# EAGLE design board 2 (EAGLE 8.4.1)
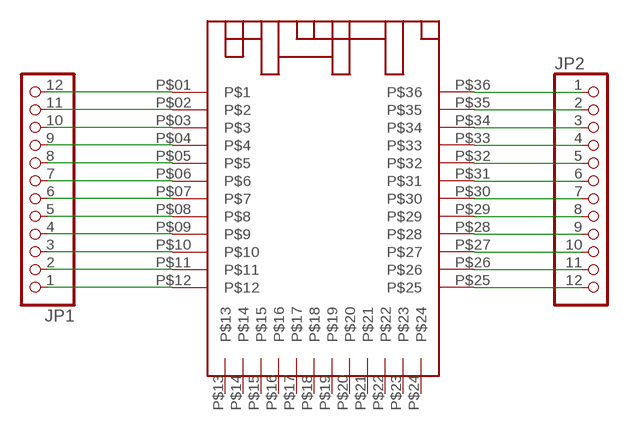
[diagram p0: schematic, sheet 1]

## Parts
JP1  PINHD-1X12  [1X12]
JP2  PINHD-1X12  [1X12]
U$1  HZX_MODULE  [SMD_PAD_VERSION]

## Nets
N$1: JP1.1 U$1.P$12
N$2: JP1.2 U$1.P$11
N$3: JP1.3 U$1.P$10
N$4: JP1.4 U$1.P$09
N$5: JP1.5 U$1.P$08
N$6: JP1.6 U$1.P$07
N$7: JP1.7 U$1.P$06
N$8: JP1.8 U$1.P$05
N$9: JP1.9 U$1.P$04
N$10: JP1.10 U$1.P$03
N$11: JP1.11 U$1.P$02
N$12: JP1.12 U$1.P$01
N$13: JP2.1 U$1.P$36
N$14: JP2.2 U$1.P$35
N$15: JP2.3 U$1.P$34
N$16: JP2.4 U$1.P$33
N$17: JP2.5 U$1.P$32
N$18: JP2.6 U$1.P$31
N$19: JP2.7 U$1.P$30
N$20: JP2.8 U$1.P$29
N$21: JP2.9 U$1.P$28
N$22: JP2.10 U$1.P$27
N$23: JP2.11 U$1.P$26
N$24: JP2.12 U$1.P$25
Unconnected: U$1.P$13 U$1.P$14 U$1.P$15 U$1.P$16 U$1.P$17 U$1.P$18 U$1.P$19 U$1.P$20 U$1.P$21 U$1.P$22 U$1.P$23 U$1.P$24

## Library data of the parts
JP1 JP2 = pinhead:PINHD-1X12: PIN HEADER
U$1 = HZX_MODULE:HZX_MODULE; AUTHOR: Agam

## Board
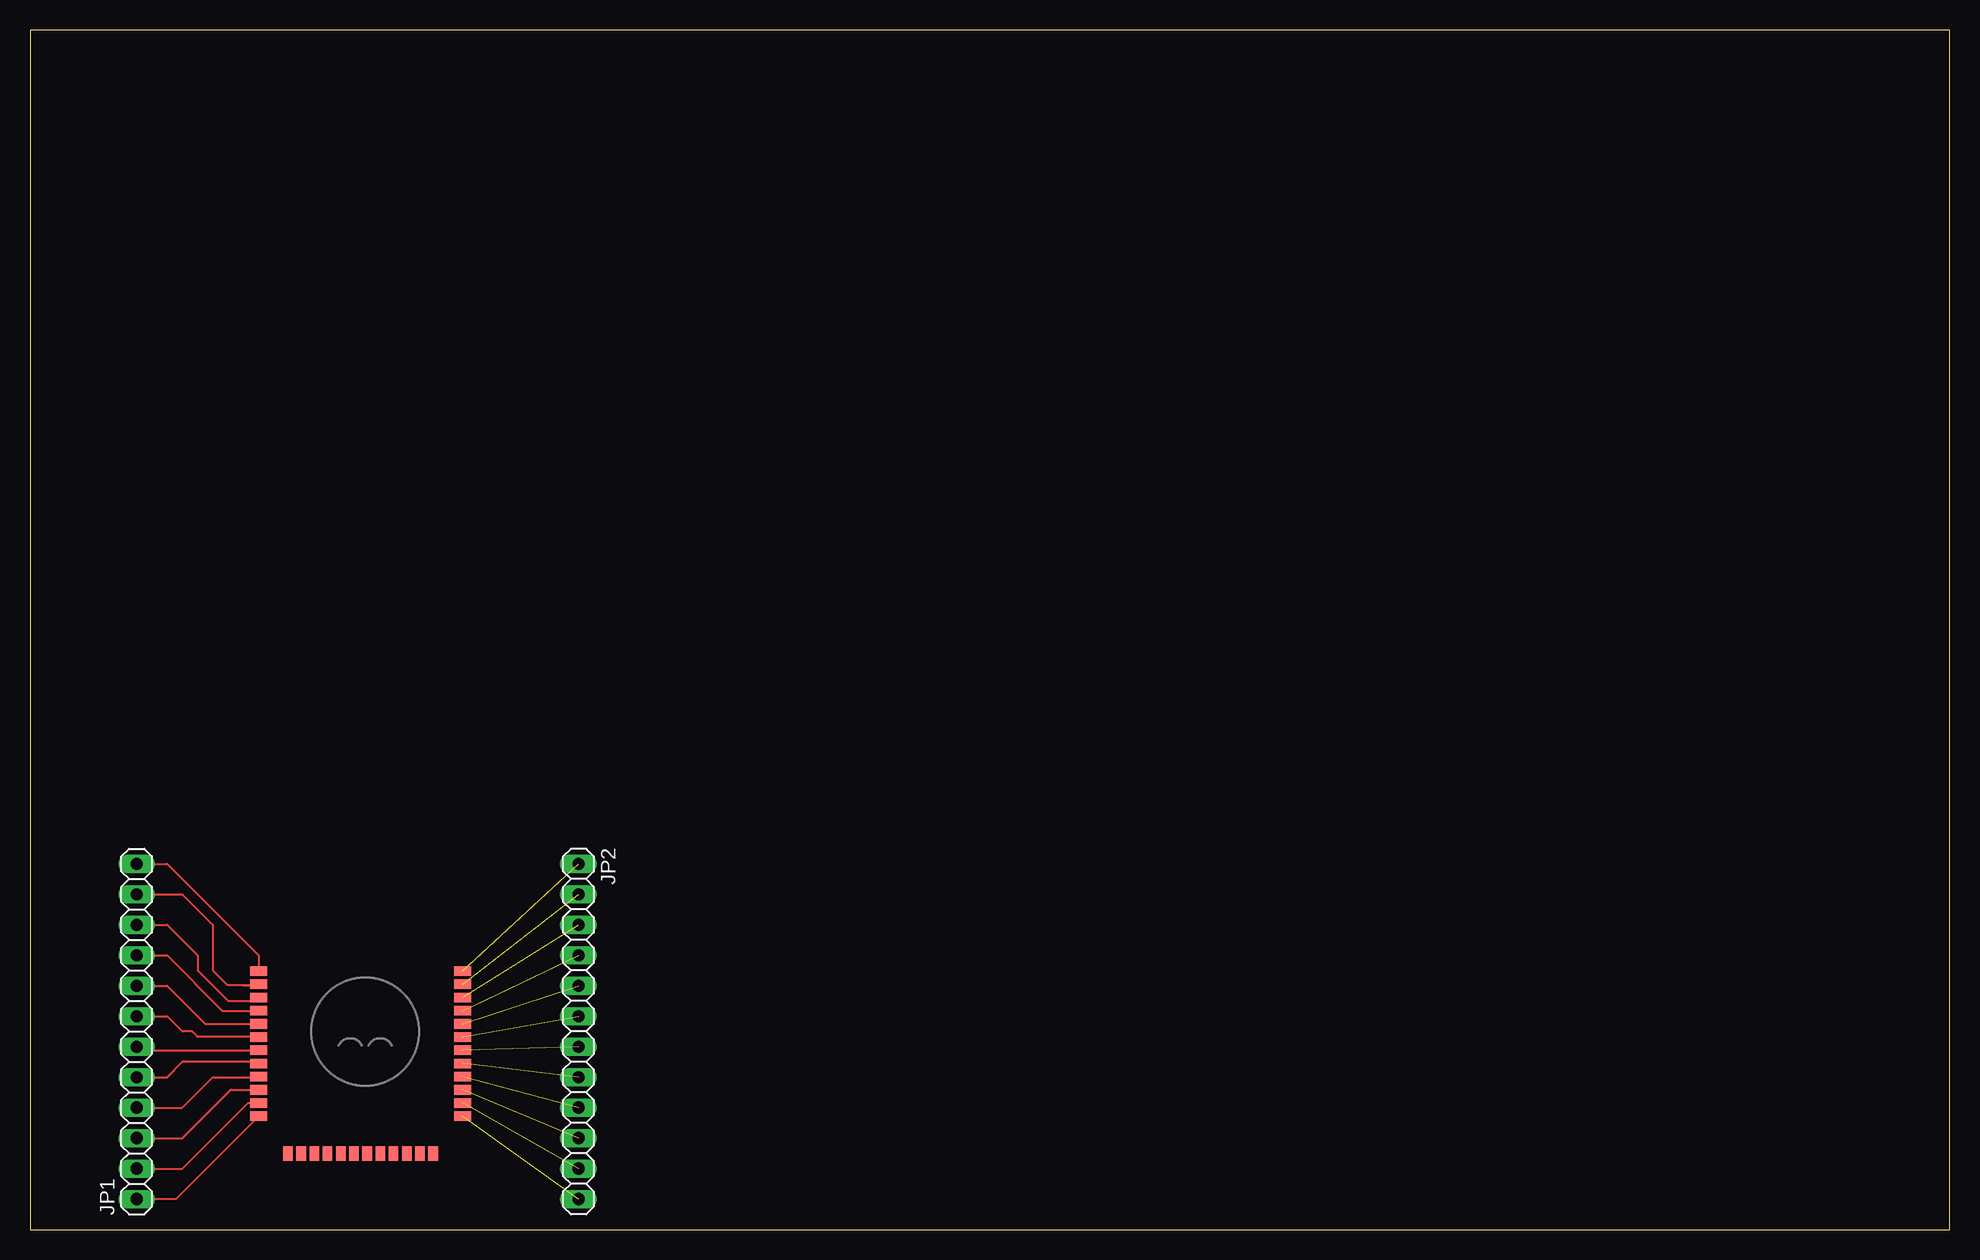
[diagram p1: board, top side]

Size 160 x 100 mm. Coordinates in mm from the lower left corner, seen from the top.
Outline: 0,0 160,0 160,100 0,100 0,0
Copper layers (1*16): Top 0.035mm / dielectric 1.5mm / Bottom 0.035mm
Design rules "default": minimum track width 6mil, minimum drill 0.35mm, track to track 6mil, track to pad 6mil, pad to pad 6mil, via to via 6mil, smd to smd 6mil, copper to edge 40mil, drill to drill 6mil, minimum pad ring 10mil, minimum via ring 8mil, stop-mask expansion 4mil, vias tented up to drill 0mil, thermal gap 10mil

### Footprints (pad centres in the part's own frame; a part is rotated, then mirrored left to right if it is on the bottom)
1X12 = drill 1.016 long: 1 -13.97,0; 2 -11.43,0; 3 -8.89,0; 4 -6.35,0; 5 -3.81,0; 6 -1.27,0; 7 1.27,0; 8 3.81,0; 9 6.35,0; 10 8.89,0; 11 11.43,0; 12 13.97,0
SMD_PAD_VERSION = smd 1.4 x 0.8: P$01 0,15.2; P$02 0,14.1; P$03 0,13; P$04 0,11.9; P$05 0,10.8; P$06 0,9.7; P$07 0,8.6; P$08 0,7.5; P$09 0,6.4; P$10 0,5.3; P$11 0,4.2; P$12 0,3.1; P$25 17,3.1; P$26 17,4.2; P$27 17,5.3; P$28 17,6.4; P$29 17,7.5; P$30 17,8.6; P$31 17,9.7; P$32 17,10.8; P$33 17,11.9; P$34 17,13; P$35 17,14.1; P$36 17,15.2 | smd 0.8 x 1.2: P$13 2.45,0; P$14 3.55,0; P$15 4.65,0; P$16 5.75,0; P$17 6.85,0; P$18 7.95,0; P$19 9.05,0; P$20 10.15,0; P$21 11.25,0; P$22 12.35,0; P$23 13.45,0; P$24 14.55,0

### Placement (x,y rotation side)
JP1  8.89,16.51 90 top
JP2  45.72,16.51 270 top
U$1  19.05,6.35 0 top
U$2  [LOGO]  27.94,16.51 0 top

### Tracks (layer width: path | path; a pad name or v marks a point on that pad's centre or on a via)
N$1
  Top 0.152: U$1.P$12 12.14,2.54 JP1.1
N$2
  Top 0.152: JP1.2 12.7,5.08 18.17,10.55 U$1.P$11
N$3
  Top 0.152: JP1.3 12.7,7.62 16.73,11.65 U$1.P$10
N$4
  Top 0.152: JP1.4 12.7,10.16 15.24,12.7 19.05,12.7 U$1.P$09
N$5
  Top 0.152: JP1.5 11.43,12.7 12.7,13.97 19.05,13.97 U$1.P$08
N$6
  Top 0.152: JP1.6 9.18,14.95 U$1.P$07
N$7
  Top 0.152: U$1.P$06 13.97,16.05 13.51,16.51 12.7,16.51 11.43,17.78 JP1.7
N$8
  Top 0.152: JP1.8 11.43,20.32 14.6,17.15 U$1.P$05
N$9
  Top 0.152: JP1.9 11.43,22.86 16.04,18.25 U$1.P$04
N$10
  Top 0.152: JP1.10 11.43,25.4 13.97,22.86 13.97,21.59 16.51,19.05 19.05,19.05 U$1.P$03
N$11
  Top 0.152: 18.98,20.39 U$1.P$02 | 18.98,20.39 18.92,20.32 17.78,20.32 | 18.98,20.39 16.45,20.39 15.24,21.59 15.24,25.4 12.7,27.94 JP1.11
N$12
  Top 0.152: JP1.12 11.43,30.48 19.05,22.86 U$1.P$01
N$13  (1 unrouted)
N$14  (1 unrouted)
N$15  (1 unrouted)
N$16  (1 unrouted)
N$17  (1 unrouted)
N$18  (1 unrouted)
N$19  (1 unrouted)
N$20  (1 unrouted)
N$21  (1 unrouted)
N$22  (1 unrouted)
N$23  (1 unrouted)
N$24  (1 unrouted)